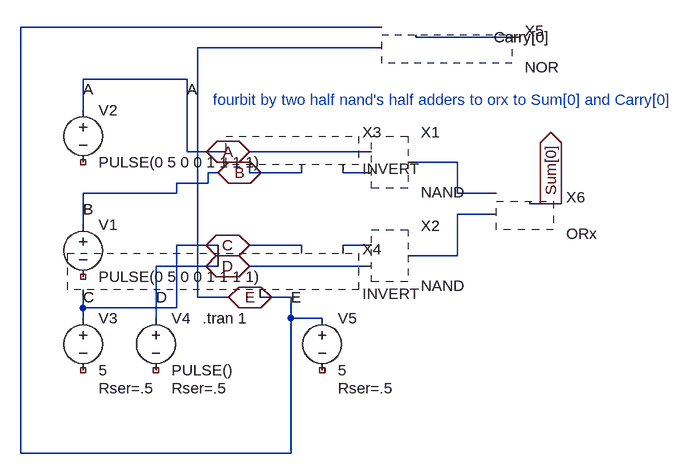
[diagram p0: schematic two_half_adder_to_nand_to_Xor_with_carry_through_and.asc]
two_half_adder_to_nand_to_Xor_with_carry_through_and.asc, the LTspice schematic file:
Version 4.1
SHEET 1 880 680
WIRE 96 -112 -432 -112
WIRE 112 -112 96 -112
WIRE 192 -96 176 -96
WIRE 336 -96 192 -96
WIRE 96 -80 -160 -80
WIRE 112 -80 96 -80
WIRE -176 -32 -336 -32
WIRE -336 16 -336 -32
WIRE -176 80 -176 -32
WIRE -128 80 -176 80
WIRE 80 80 -80 80
WIRE 96 80 80 80
WIRE 240 96 176 96
WIRE -128 112 -144 112
WIRE -16 112 -80 112
WIRE 0 112 -16 112
WIRE 80 112 64 112
WIRE 96 112 80 112
WIRE -144 128 -144 112
WIRE -144 128 -192 128
WIRE -192 144 -192 128
WIRE -192 144 -336 144
WIRE 240 144 240 96
WIRE 272 144 240 144
WIRE 288 144 272 144
WIRE 368 160 352 160
WIRE 384 160 368 160
WIRE 400 160 384 160
WIRE 272 176 240 176
WIRE 288 176 272 176
WIRE -336 192 -336 144
WIRE -128 224 -192 224
WIRE -16 224 -80 224
WIRE 0 224 -16 224
WIRE 80 224 64 224
WIRE 96 224 80 224
WIRE 240 240 240 176
WIRE 240 240 176 240
WIRE -128 256 -224 256
WIRE 80 256 -80 256
WIRE 96 256 80 256
WIRE -160 304 -160 -80
WIRE -112 304 -160 304
WIRE -16 304 -64 304
WIRE -336 320 -336 304
WIRE -192 320 -192 224
WIRE -192 320 -336 320
WIRE -336 336 -336 320
WIRE -224 336 -224 256
WIRE -16 336 -16 304
WIRE 32 336 -16 336
WIRE -432 544 -432 -112
WIRE -16 544 -16 336
WIRE -16 544 -432 544
FLAG 384 160 Sum[0]
IOPIN 384 160 Out
FLAG -80 80 A
IOPIN -80 80 BiDir
FLAG -80 256 D
IOPIN -80 256 BiDir
FLAG -80 224 C
IOPIN -80 224 BiDir
FLAG -128 112 B
IOPIN -128 112 BiDir
FLAG -112 304 E
IOPIN -112 304 BiDir
SYMBOL INVERT 16 224 R0
SYMATTR InstName X4
SYMBOL ORx 320 160 R0
SYMATTR InstName X6
SYMBOL INVERT 16 112 R0
WINDOW 39 8 4 Bottom 2
SYMATTR InstName X3
SYMBOL NAND 128 96 R0
SYMATTR InstName X1
SYMBOL NAND 128 240 R0
SYMATTR InstName X2
SYMBOL voltage -336 176 R0
WINDOW 123 0 0 Left 0
WINDOW 39 0 0 Left 0
SYMATTR InstName V1
SYMATTR Value PULSE(0 5 0 0 1 1 1 1)
SYMBOL voltage -336 0 R0
WINDOW 123 0 0 Left 0
WINDOW 39 0 0 Left 0
SYMATTR InstName V2
SYMATTR Value PULSE(0 5 0 0 1 1 1 1)
SYMBOL voltage -336 320 R0
WINDOW 123 0 0 Left 0
WINDOW 39 24 124 Left 2
SYMATTR InstName V3
SYMATTR Value 5
SYMATTR SpiceLine Rser=.5
SYMBOL voltage -224 320 R0
WINDOW 123 0 0 Left 0
WINDOW 39 24 124 Left 2
SYMATTR InstName V4
SYMATTR Value PULSE()
SYMATTR SpiceLine Rser=.5
SYMBOL voltage 32 320 R0
WINDOW 123 0 0 Left 0
WINDOW 39 24 124 Left 2
SYMATTR InstName V5
SYMATTR Value 5
SYMATTR SpiceLine Rser=.5
SYMBOL NOR 144 -96 R0
SYMATTR InstName X5
TEXT -152 336 Left 2 !.tran 1
TEXT -136 0 Left 2 ;fourbit by two half nand's half adders to orx to Sum[0] and Carry[0]
TEXT -336 -16 Left 2 !A
TEXT -336 168 Left 2 !B
TEXT 296 -96 Left 2 !Carry[0]
TEXT -336 304 Left 2 !C
TEXT -176 -16 Left 2 !A
TEXT -224 304 Left 2 !D
TEXT -16 304 Left 2 !E

The netlist it stands for:
* two_half_adder_to_nand_to_Xor_with_carry_through_and.asc
* X4: INVERT (symbol INVERT not available, pin order unknown); nets seen at it: C, N001, N008, N009, N010
* X6: ORx (symbol ORx not available, pin order unknown); nets seen at it: N004, N007, Sum[0]
* X3: INVERT (symbol INVERT not available, pin order unknown); nets seen at it: N003, N005, N006
* X1: NAND (symbol NAND not available, pin order unknown); nets seen at it: A, N004, N006
* X2: NAND (symbol NAND not available, pin order unknown); nets seen at it: D, N007, N009
V1 B NC_01 PULSE(0 5 0 0 1 1 1 1)
V2 N003 NC_02 PULSE(0 5 0 0 1 1 1 1)
V3 N008 NC_03 5 Rser=.5
V4 N010 NC_04 PULSE() Rser=.5
V5 N001 NC_05 5 Rser=.5
* X5: NOR (symbol NOR not available, pin order unknown); nets seen at it: E, N001, N002
.tran 1
* fourbit by two half nand's half adders to orx to Sum[0] and Carry[0]
A
B
Carry[0]
C
A
D
E
.backanno
.end